# EAGLE design Four Monks Expander 1 (mix lvl) (EAGLE 7.7.0)
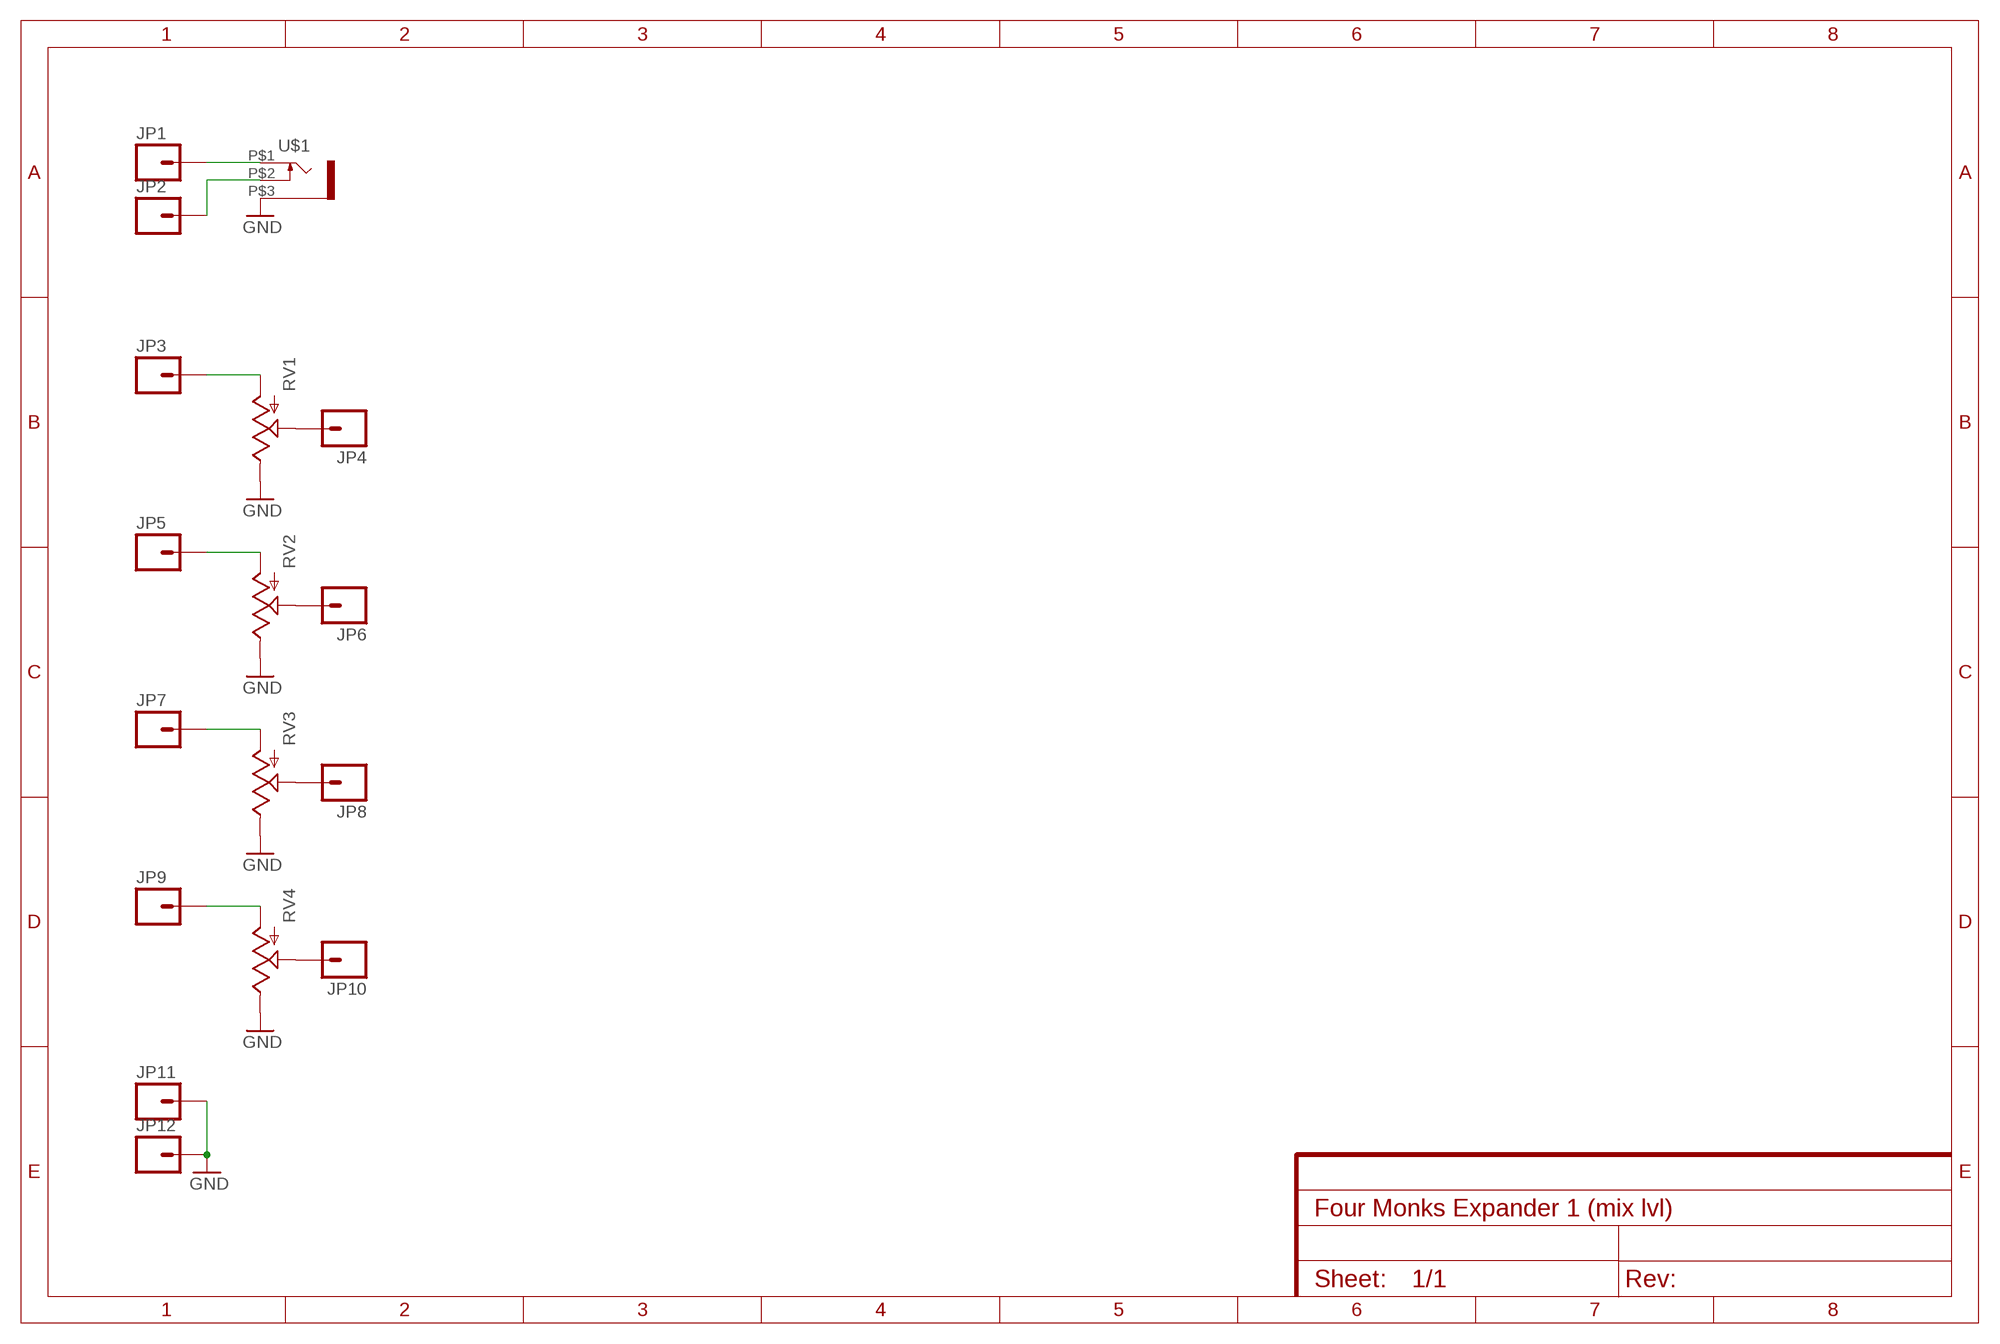
[diagram p0: schematic, sheet 1]

## Parts
JP1  M01PTH  [1X01]
JP2  M01PTH  [1X01]
JP3  M01PTH  [1X01]
JP4  M01PTH  [1X01]
JP5  M01PTH  [1X01]
JP6  M01PTH  [1X01]
JP7  M01PTH  [1X01]
JP8  M01PTH  [1X01]
JP9  M01PTH  [1X01]
JP10  M01PTH  [1X01]
JP11  M01PTH  [1X01]
JP12  M01PTH  [1X01]
RV1  POT  [ALPS_POT]
RV2  POT  [ALPS_POT]
RV3  POT  [ALPS_POT]
RV4  POT  [ALPS_POT]
U$1  WQP-PJ301M-12_JACK  [WQP-PJ301M-12_JACK]

## Nets
GND: JP11.1 JP12.1 RV1.P$1(E) RV2.P$1(E) RV3.P$1(E) RV4.P$1(E) U$1.P$3
N$1: JP4.1 RV1.P$2(S)
N$2: JP6.1 RV2.P$2(S)
N$3: JP8.1 RV3.P$2(S)
N$4: JP10.1 RV4.P$2(S)
N$5: JP9.1 RV4.P$3(A)
N$6: JP7.1 RV3.P$3(A)
N$7: JP5.1 RV2.P$3(A)
N$8: JP3.1 RV1.P$3(A)
N$9: JP1.1 U$1.P$1
N$10: JP2.1 U$1.P$2

## Library data of the parts
JP1-JP12 = SparkFun-Connectors:M01: Header 1 Standard 1-pin 0.1" header. Use with straight break away headers (SKU : PRT-00116), right angle break away headers (PRT-00553), swiss pins (PRT-00743), machine pins (PRT-00117), and female headers (PRT-00115).
RV1-RV4 = SparkFun-Electromechanical:POT; PROD_ID: RES-09177
U$1 = thonkiconn:WQP-PJ301M-12_JACK

## Board
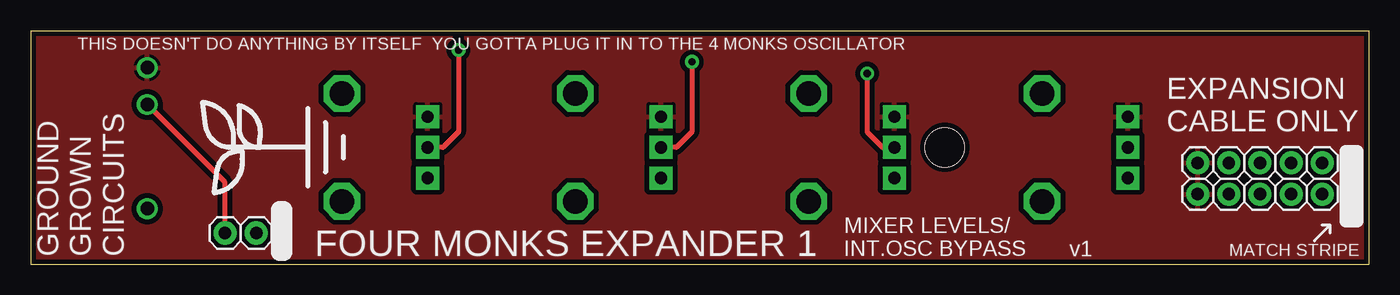
[diagram p1: board, top side]
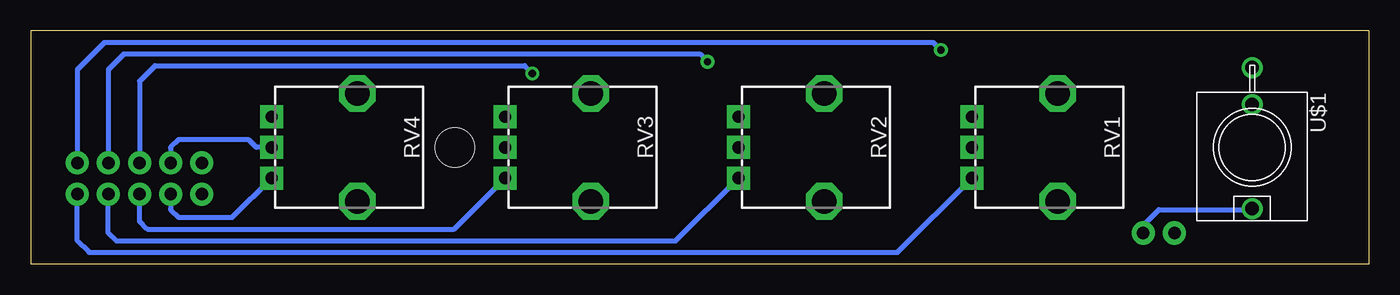
[diagram p2: board, bottom side, seen from below]

Size 109.22 x 19.05 mm. Coordinates in mm from the lower left corner, seen from the top.
Outline: 0,0 109.22,0 109.22,19.05 0,19.05 0,0
Copper layers (1*16): Top 0.035mm / dielectric 1.5mm / Bottom 0.035mm
Design rules "SparkFun": minimum track width 8mil, minimum drill 20mil, track to track 8mil, track to pad 8mil, pad to pad 8mil, via to via 8mil, smd to smd 8mil, copper to edge 8mil, drill to drill 8mil, minimum pad ring 12mil, minimum via ring 10mil, stop-mask expansion 4mil, vias tented up to drill 20mil, thermal gap 10mil
Holes 3.2 mm at 74.61,9.53

### Footprints (pad centres in the part's own frame; a part is rotated, then mirrored left to right if it is on the bottom)
1X01 = drill 1.016 pad 1.88: 1 0,0
ALPS_POT = drill 1 pad 1.88 square: P$1 7,-2.5; P$2 7,0; P$3 7,2.5 | drill 2 octagon: P$4 0,-4.4; P$5 0,4.4
WQP-PJ301M-12_JACK = drill 1.1: P$1 0,5; P$2 0,-3.5; P$3 0,-6.5

### Placement (x,y rotation side)
JP1  18.41,2.54 0 top
JP2  15.88,2.54 0 top
JP3  105.41,5.71 180 top
JP4  105.41,8.26 0 top
JP5  102.87,5.71 180 top
JP6  102.87,8.26 0 top
JP7  100.33,5.71 180 top
JP8  100.33,8.26 0 top
JP9  97.79,5.71 180 top
JP10  97.79,8.26 0 top
JP11  95.25,5.71 180 top
JP12  95.25,8.26 0 top
RV1  25.4,9.53 180 bottom
RV2  44.45,9.53 180 bottom
RV3  63.5,9.53 180 bottom
RV4  82.55,9.53 180 bottom
U$1  9.53,9.53 180 bottom
U$2  [LOGO_MED]  22.54,9.53 90 top

### Tracks (layer width: path | path; a pad name or v marks a point on that pad's centre or on a via)
GND
  pour Top (isolate 0.406): 0,0 109.22,0 109.22,19.05 0,19.05
N$1  (via drill 0.6)
  Top 0.406: v34.92,17.46 34.92,10.79 33.66,9.53 RV1.P$2
  Bottom 0.406: v34.92,17.46 35.56,18.1 103.19,18.1 105.41,15.88 JP4.1
N$2  (via drill 0.6)
  Top 0.406: v53.98,16.51 53.98,10.79 52.7,9.53 RV2.P$2
  Bottom 0.406: v53.98,16.51 54.61,17.14 101.6,17.14 102.87,15.88 JP6.1
N$3  (via drill 0.6)
  Top 0.406: v68.26,15.56 68.26,10.79 69.53,9.53 RV3.P$2
  Bottom 0.406: v68.26,15.56 68.9,16.19 99.06,16.19 100.33,14.92 JP8.1
N$4
  Bottom 0.406: RV4.P$2 90.81,9.53 91.44,10.16 97.16,10.16 97.79,9.53 JP10.1
N$5
  Bottom 0.406: JP9.1 97.79,4.45 97.16,3.81 92.77,3.81 RV4.P$3
N$6
  Bottom 0.406: RV3.P$3 74.67,2.86 99.69,2.86 100.33,3.49 JP7.1
N$7
  Bottom 0.406: RV2.P$3 56.57,1.91 102.23,1.91 102.87,2.54 JP5.1
N$8
  Bottom 0.406: RV1.P$3 38.47,0.95 104.46,0.95 105.41,1.91 JP3.1
N$9
  Bottom 0.406: JP1.1 18.41,3.17 17.14,4.45 9.61,4.45 U$1.P$1
N$10
  Top 0.406: JP2.1 15.88,6.67 U$1.P$2

### Text on the board
tPlace: THIS DOESN'T DO ANYTHING BY ITSELF YOU GOTTA PLUG IT IN TO THE 4 MONKS OSCILLATOR | EXPANSION / CABLE ONLY | GROUND / GROWN / CIRCUITS | FOUR MONKS EXPANDER 1 | MIXER LEVELS/ / INT.OSC BYPASS | v1 | MATCH STRIPE